# EAGLE design autolock (EAGLE 9.6.2)
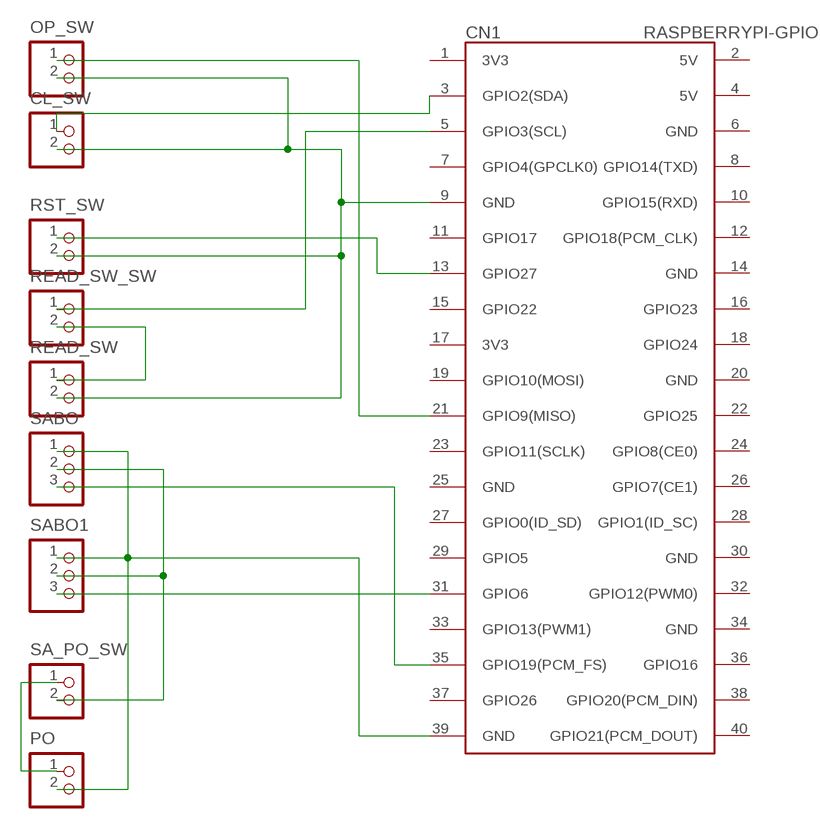
[diagram p0: schematic, sheet 1]

## Parts
CL_SW  B2B-XH-A  [B2B-XH-A]
CN1  RASPBERRYPI-GPIO  [2X20-BOLD]
OP_SW  B2B-XH-A  [B2B-XH-A]
PO  B2B-XH-A  [B2B-XH-A]
READ_SW  B2B-XH-A  [B2B-XH-A]
READ_SW_SW  B2B-XH-A  [B2B-XH-A]
RST_SW  B2B-XH-A  [B2B-XH-A]
SA_PO_SW  B2B-XH-A  [B2B-XH-A]
SABO  B3B-XH-A  [B3B-XH-A]
SABO1  B3B-XH-A  [B3B-XH-A]

## Nets
GND: CL_SW.2 CN1.9(GND) CN1.39(GND) OP_SW.2 PO.2 READ_SW.2 RST_SW.2 SABO1.1 SABO.1
N$1: CN1.21(GPIO9(MISO)) OP_SW.1
N$2: CL_SW.1 CN1.3(GPIO2(SDA))
N$3: CN1.5(GPIO3(SCL)) READ_SW_SW.1
N$5: PO.1 SA_PO_SW.1
N$6: SA_PO_SW.2 SABO1.2 SABO.2
N$7: CN1.35(GPIO19(PCM_FS)) SABO.3
N$10: CN1.31(GPIO6) SABO1.3
N$11: READ_SW.1 READ_SW_SW.2
N$14: CN1.13(GPIO27) RST_SW.1
Unconnected: CN1.1(3V3) CN1.2(5V) CN1.4(5V) CN1.6(GND) CN1.7(GPIO4(GPCLK0)) CN1.8(GPIO14(TXD)) CN1.10(GPIO15(RXD)) CN1.11(GPIO17) CN1.12(GPIO18(PCM_CLK)) CN1.14(GND) CN1.15(GPIO22) CN1.16(GPIO23) CN1.17(3V3) CN1.18(GPIO24) CN1.19(GPIO10(MOSI)) CN1.20(GND) CN1.22(GPIO25) CN1.23(GPIO11(SCLK)) CN1.24(GPIO8(CE0)) CN1.25(GND) CN1.26(GPIO7(CE1)) CN1.27(GPIO0(ID_SD)) CN1.28(GPIO1(ID_SC)) CN1.29(GPIO5) CN1.30(GND) CN1.32(GPIO12(PWM0)) CN1.33(GPIO13(PWM1)) CN1.34(GND) CN1.36(GPIO16) CN1.37(GPIO26) CN1.38(GPIO20(PCM_DIN)) CN1.40(GPIO21(PCM_DOUT))

## Library data of the parts
CL_SW OP_SW PO READ_SW READ_SW_SW RST_SW SA_PO_SW = jst-xh:B2B-XH-A: Wire-to-Board 2.5mm pitch top mount connector Source: http://www.jst-mfg.com/product/pdf/jpn/XH.pdf http://www.jst-mfg.com/product/detail.php?series=277
CN1 = GPIO:RASPBERRYPI-GPIO
SABO SABO1 = jst-xh:B3B-XH-A: Wire-to-Board 2.5mm pitch top mount connector Source: http://www.jst-mfg.com/product/pdf/jpn/XH.pdf http://www.jst-mfg.com/product/detail.php?series=277

## Board
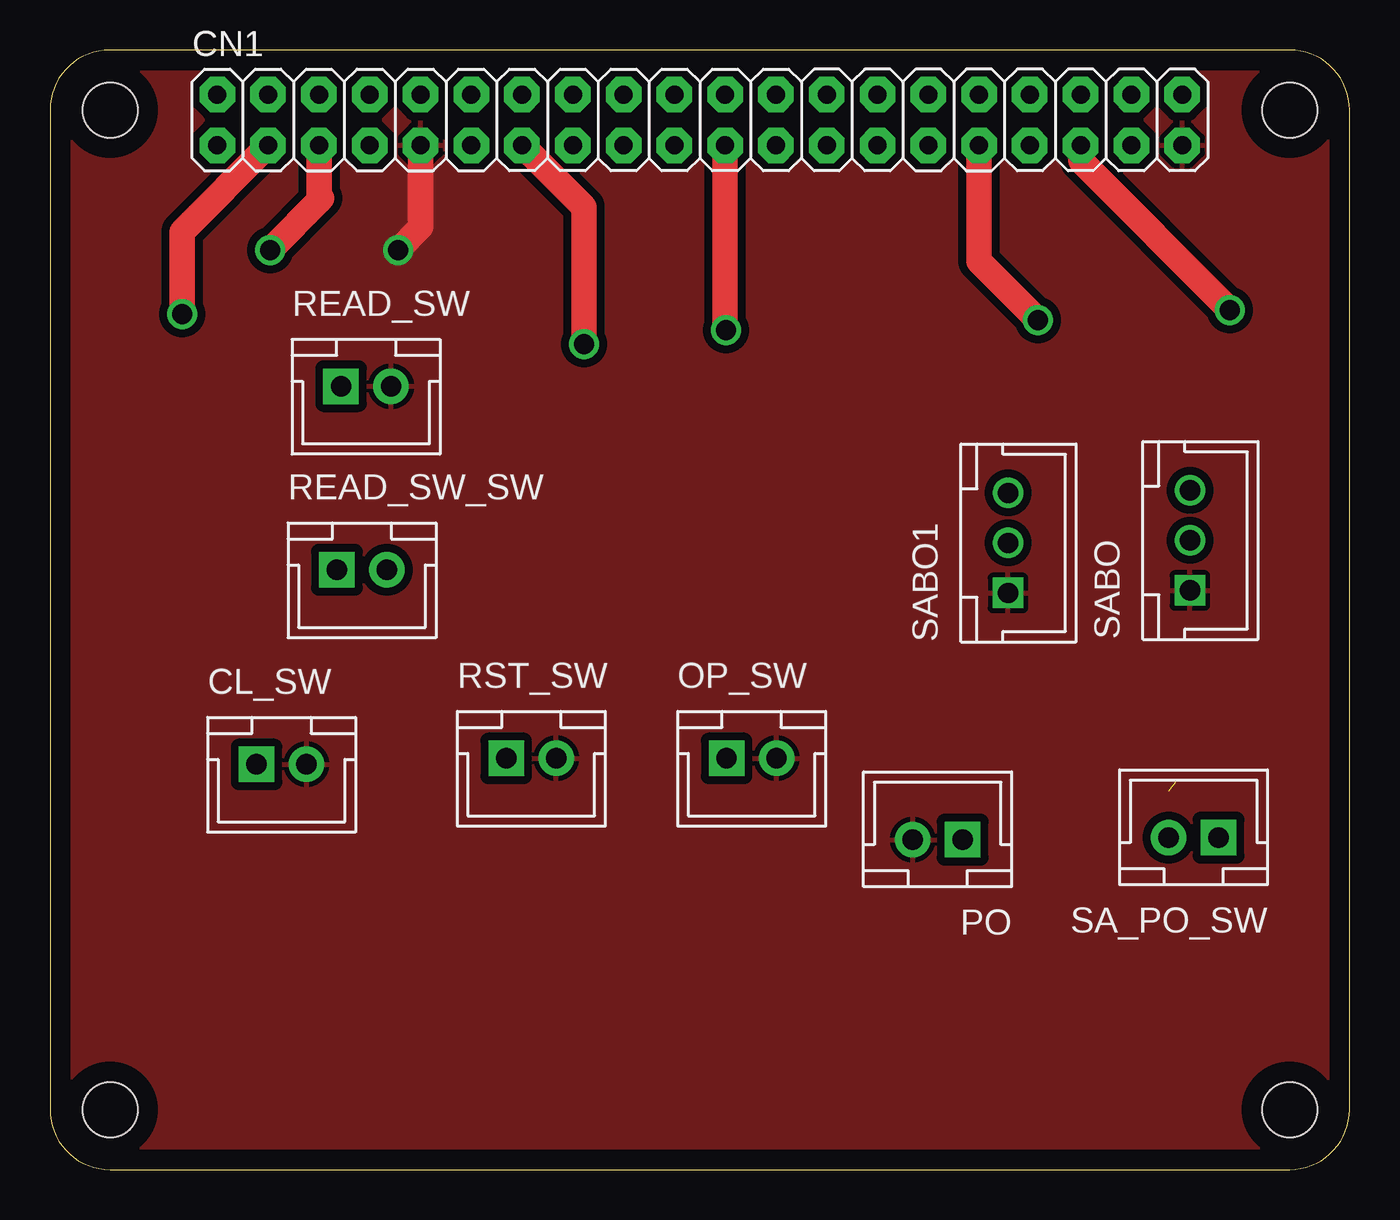
[diagram p1: board, top side]
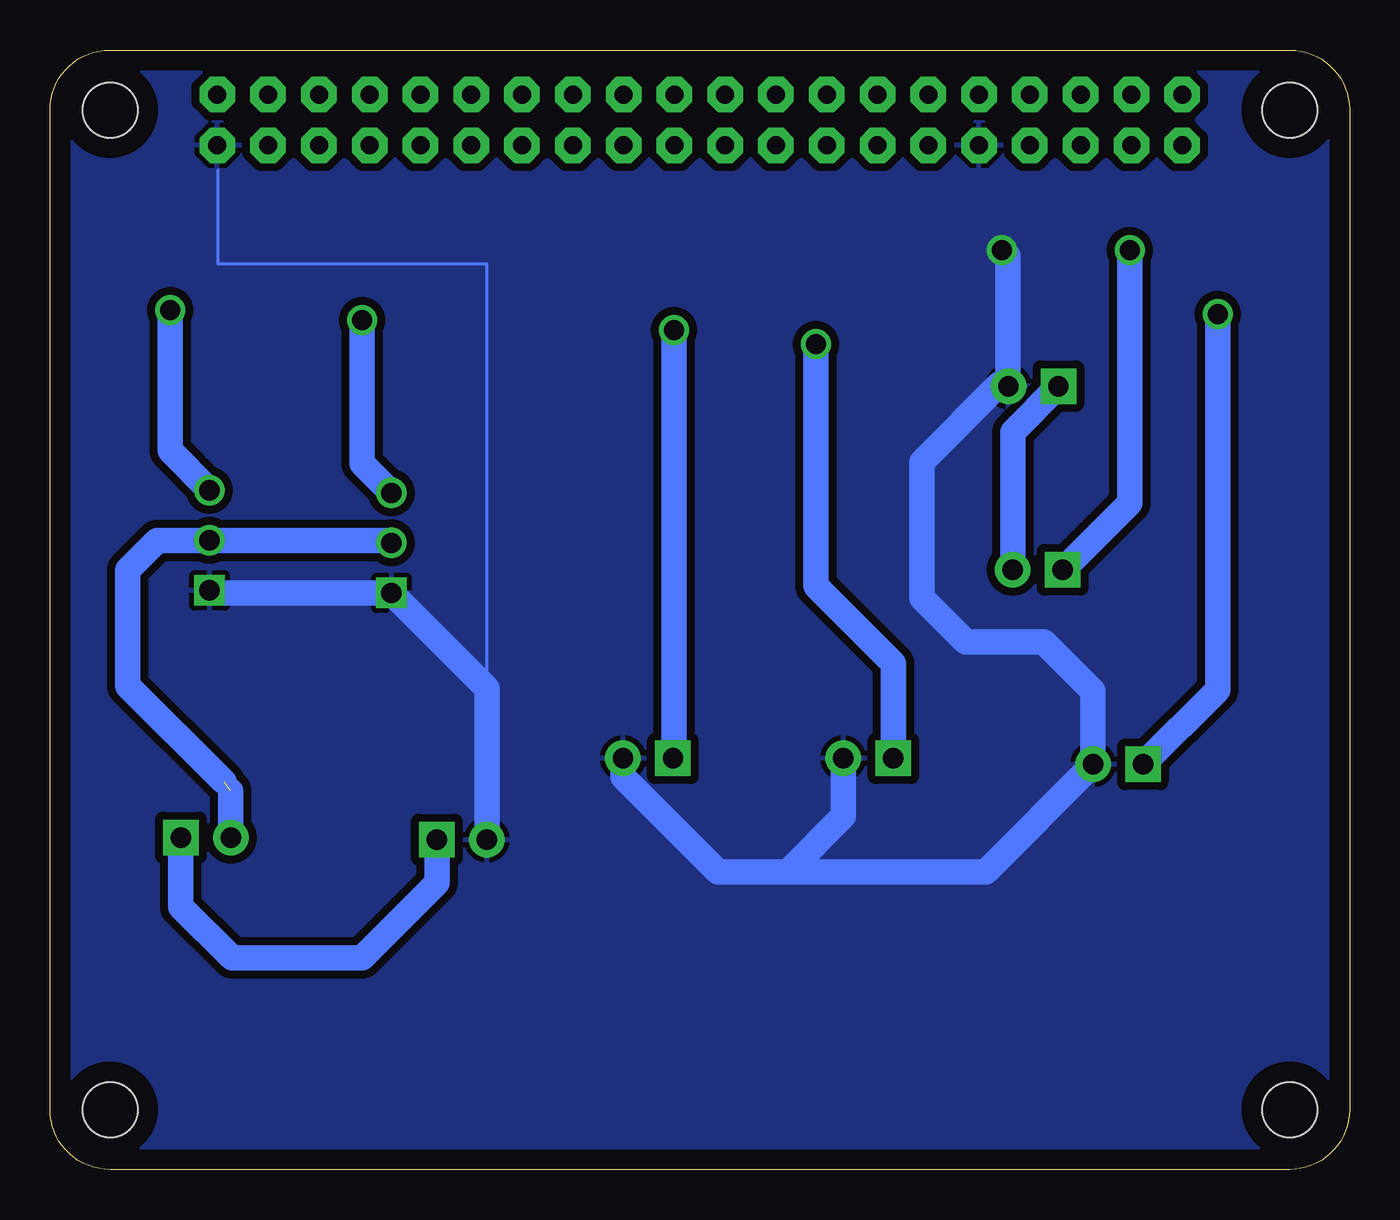
[diagram p2: board, bottom side, seen from below]

Size 65 x 56 mm. Coordinates in mm from the lower left corner, seen from the top.
Outline: 0,53 0,3 arc90 3,0 62,0 arc90 65,3 65,53 arc90 62,56 3,56 arc90 0,53
Copper layers (1*16): Top 0.035mm / dielectric 1.5mm / Bottom 0.035mm
Design rules "default": minimum track width 6mil, minimum drill 0.35mm, track to track 6mil, track to pad 6mil, pad to pad 6mil, via to via 6mil, smd to smd 6mil, copper to edge 40mil, drill to drill 6mil, minimum pad ring 10mil, minimum via ring 8mil, stop-mask expansion 4mil, vias tented up to drill 0mil, thermal gap 10mil
Holes 2.75 mm at 3,53 62,53 3,3 62,3

### Footprints (pad centres in the part's own frame; a part is rotated, then mirrored left to right if it is on the bottom)
B2B-XH-A = drill 1.016 pad 1.778 square: 1 -1.25,0 | drill 1.016 pad 1.778: 2 1.25,0
2X20-BOLD = drill 0.9 pad 1.778 octagon: 1 -24.13,-1.27; 2 -24.13,1.27; 3 -21.59,-1.27; 4 -21.59,1.27; 5 -19.05,-1.27; 6 -19.05,1.27; 7 -16.51,-1.27; 8 -16.51,1.27; 9 -13.97,-1.27; 10 -13.97,1.27; 11 -11.43,-1.27; 12 -11.43,1.27; 13 -8.89,-1.27; 14 -8.89,1.27; 15 -6.35,-1.27; 16 -6.35,1.27; 17 -3.81,-1.27; 18 -3.81,1.27; 19 -1.27,-1.27; 20 -1.27,1.27; 21 1.27,-1.27; 22 1.27,1.27; 23 3.81,-1.27; 24 3.81,1.27; 25 6.35,-1.27; 26 6.35,1.27; 27 8.89,-1.27; 28 8.89,1.27; 29 11.43,-1.27; 30 11.43,1.27; 31 13.97,-1.27; 32 13.97,1.27; 33 16.51,-1.27; 34 16.51,1.27; 35 19.05,-1.27; 36 19.05,1.27; 37 21.59,-1.27; 38 21.59,1.27; 39 24.13,-1.27; 40 24.13,1.27
B3B-XH-A = drill 1.016 square: 1 -2.5,0 | drill 1.016: 2 0,0; 3 2.5,0

### Placement (x,y rotation side)
CL_SW  11.58,20.27 0 top
CN1  32.5,52.5 0 top
OP_SW  35.09,20.57 0 top
PO  44.4,16.5 180 top
READ_SW  15.81,39.18 0 top
READ_SW_SW  15.6,30 0 top
RST_SW  24.07,20.57 0 top
SA_PO_SW  57.2,16.6 180 top
SABO  57.02,31.47 90 top
SABO1  47.92,31.34 90 top

### Tracks (layer width: path | path; a pad name or v marks a point on that pad's centre or on a via)
GND  (via drill 1 pad 0.3)
  Top 1.27: CN1.9 18.53,47.13 v17.4,46
  Bottom 0.152: 56.6,50.01 56.6,45.3 43.15,45.3 PO.2
  Bottom 1.27: v17.4,46 17.1,45.7 17.1,39.32 17.48,39.32 21.4,35.4 21.4,28.6 19.2,26.4 15.3,26.4 12.83,23.93 CL_SW.2 18.2,14.9 28.1,14.9 | 28.1,14.9 31.6,14.9 36.34,19.64 OP_SW.2 | RST_SW.2 25.32,17.68 28.1,14.9 | SABO.1 56.89,28.84 SABO1.1 43.15,24.07 PO.2
  pour Top (isolate 0.4): -3,57.3 -3,-0.8 67.1,-0.8 67.1,57.3
  pour Bottom (isolate 0.4): -3.9,58.1 -3.9,-1.7 69.4,-1.7 69.4,58.1
N$1  (via drill 1 pad 0.3)
  Top 1.27: CN1.21 33.77,42.03 v33.8,42
  Bottom 1.27: v33.8,42 33.8,20.61 OP_SW.1
N$2  (via drill 1 pad 0.3)
  Top 1.27: CN1.3 6.6,46.92 v6.6,42.8
  Bottom 1.27: v6.6,42.8 6.6,24 CL_SW.1
N$3  (via drill 1 pad 0.3)
  Top 1.27: CN1.5 13.45,48.6 13.6,48.6 v11,46
  Bottom 1.27: v11,46 11,33.35 READ_SW_SW.1
N$5
  Bottom 1.27: SA_PO_SW.1 58.45,13.15 55.9,10.6 49.4,10.6 45.65,14.35 PO.1
N$6  (1 unrouted)
  Bottom 1.27: SABO1.2 48.05,31.47 SABO.2 59.63,31.47 61.1,30 61.1,24.2 56.3,19.4 | 55.95,18.95 SA_PO_SW.2
N$7  (via drill 1 pad 0.3)
  Top 1.27: CN1.35 51.55,50.45 v59,43
  Bottom 1.27: v59,43 59,35.95 SABO.3
N$10  (via drill 1 pad 0.3)
  Top 1.27: CN1.31 46.47,45.43 v49.4,42.5
  Bottom 1.27: v49.4,42.5 49.4,35.32 SABO1.3
N$11
  Bottom 1.27: READ_SW.1 16.85,36.89 READ_SW_SW.2
N$14  (via drill 1 pad 0.3)
  Top 1.27: CN1.13 26.7,48.14 v26.7,41.3
  Bottom 1.27: v26.7,41.3 26.7,29.2 22.82,25.32 RST_SW.1